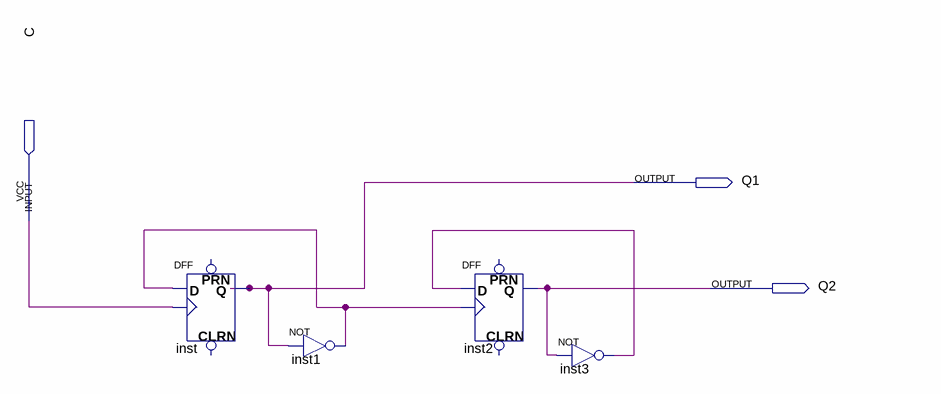
[diagram p0: schematic sheet]
// Quartus schematic CONT2Bit.bdf as structural Verilog: 4 symbols, 3 pins
module CONT2Bit (
  input  C,
  output Q1,
  output Q2
);

  wire inst1_out, inst3_out;

  DFF inst (.CLK(C), .D(inst1_out), .Q(Q1));  // open: CLRN, PRN
  not inst1 (inst1_out, Q1);
  DFF inst2 (.CLK(inst1_out), .D(inst3_out), .Q(Q2));  // open: CLRN, PRN
  not inst3 (inst3_out, Q2);
endmodule
